# EAGLE design komp_podnap (EAGLE 6.3)
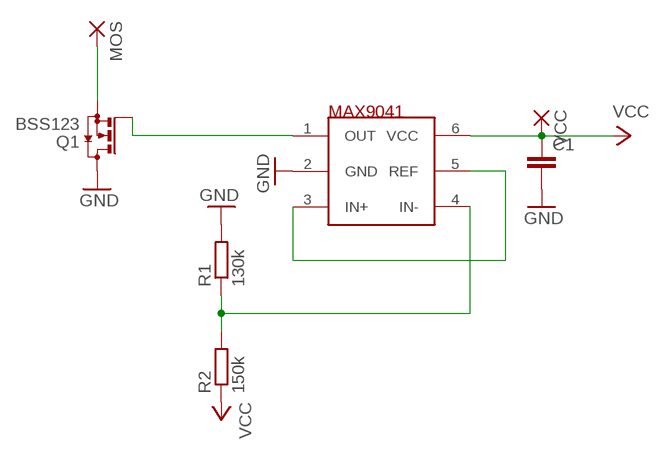
[diagram p0: schematic, sheet 1]

## Parts
C1  C-EUC0805  [C0805]
MOS  2,54/0,8  [2,54/0,8]
Q1  BSS123  [SOT23]
R1  130k  R-EU_M0805  [M0805]
R2  150k  R-EU_M0805  [M0805]
U$1  MAX9041  [SOT23-6]
VCC  2,54/0,8  [2,54/0,8]

## Nets
GND: C1.2 Q1.3(D) R1.2 U$1.2(GND)
N$1: U$1.3(IN+) U$1.5(REF)
N$2: R1.1 R2.2 U$1.4(IN-)
N$3: Q1.1(G) U$1.1(OUT)
N$4: MOS.1(P) Q1.2(S)
VCC: C1.1 R2.1 U$1.6(VCC) VCC.1(P)

## Library data of the parts
C1 = rcl:C-EU: CAPACITOR, European symbol
MOS VCC = wirepad:2,54/0,8: THROUGH-HOLE PAD
Q1 = transistor-small-signal:BSS123: N-CHANNEL MOS FET
R1 R2 = resistor:R-EU_: RESISTOR, European symbol
U$1 = ref-packages:MAX9041

## Net classes
0 default: clearance 0.7 mm

## Board
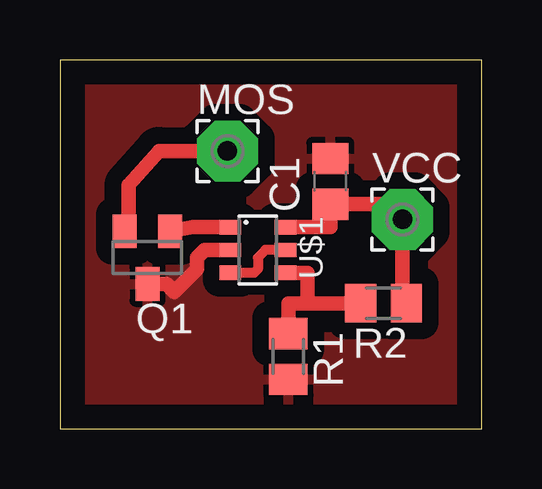
[diagram p1: board, top side]

Size 17.6 x 15.39 mm. Coordinates in mm from the lower left corner, seen from the top.
Outline: 0,0 17.6,0 17.6,15.39 0,15.39 0,0
Copper layers (1*16): Top 0.035mm / dielectric 1.5mm / Bottom 0.035mm
Design rules "default": minimum track width 10mil, minimum drill 24mil, track to track 8mil, track to pad 8mil, pad to pad 8mil, via to via 8mil, smd to smd 8mil, copper to edge 40mil, drill to drill 8mil, minimum pad ring 10mil, minimum via ring 8mil, stop-mask expansion 4mil, vias tented up to drill 0mil, thermal gap 10mil

### Footprints (pad centres in the part's own frame; a part is rotated, then mirrored left to right if it is on the bottom)
C0805 = smd 1.3 x 1.5: 1 -0.95,0; 2 0.95,0
2,54/0,8 = drill 0.813 pad 2.54 octagon: 1 0,0
SOT23 = smd 1 x 1.4: 1 -0.95,-1.1; 2 0.95,-1.1; 3 0,1.1
M0805 = smd 1.3 x 1.6: 1 -0.95,0; 2 0.95,0
SOT23-6 = smd 0.6 x 0.9: 1 -0.95,-1.15; 2 0,-1.15; 3 0.95,-1.15; 4 0.95,1.15; 5 0,1.15; 6 -0.95,1.15

### Placement (x,y rotation side)
C1  11.27,10.32 90 top
MOS  6.99,11.59 0 top
Q1  3.65,7.14 180 top
R1  9.53,3.02 270 top
R2  13.49,5.24 180 top
U$1  8.26,7.46 270 top
VCC  14.29,8.73 0 top

### Tracks (layer width: path | path; a pad name or v marks a point on that pad's centre or on a via)
GND
  Top 0.61: U$1.2 6.03,7.46 5.71,7.14 5.71,6.67 4.76,5.72 4.45,6.03 3.65,6.03
  pour Top: -7.78,-4.45 26.51,-4.45 26.51,23.5 -7.78,23.5
N$1
  Top 0.406: U$1.5 8.57,7.46 8.26,7.14 8.26,6.67 8.1,6.51 U$1.3
N$2
  Top 0.61: R2.2 10.32,5.24 | 10.32,5.24 9.53,5.24 R1.1 | U$1.4 10.32,6.51 10.32,5.24
N$3
  Top 0.61: U$1.1 5.56,8.41 Q1.1
N$4
  Top 0.61: Q1.2 2.86,8.24 2.86,10.16 4.13,11.59 MOS.1
VCC
  Top 0.61: U$1.6 11.27,8.41 C1.1 14.29,9.37 VCC.1 14.29,5.24 R2.1